# EasyEDA Pro project PAW4_NOMAG_Cheesecake-Blueberry-LSM6DSV_JST2.eprj

# Schematic LSM6DSV_QMC6309_Rv_1
Board Name: LSM6DSV_QMC6309_JST2; Create Date: 2026-08-04; Page Name: LSM6; Project Name: PAW4_NOMAG_Cheesecake-Blueberry-LSM6DSV_JST2; Schematic Name: LSM6DSV_QMC6309_Rv_1; Update Date: 2026-09-08; Company: Designed by SoraKage (& puppy sky); Page Size: A4; Version: paw-4
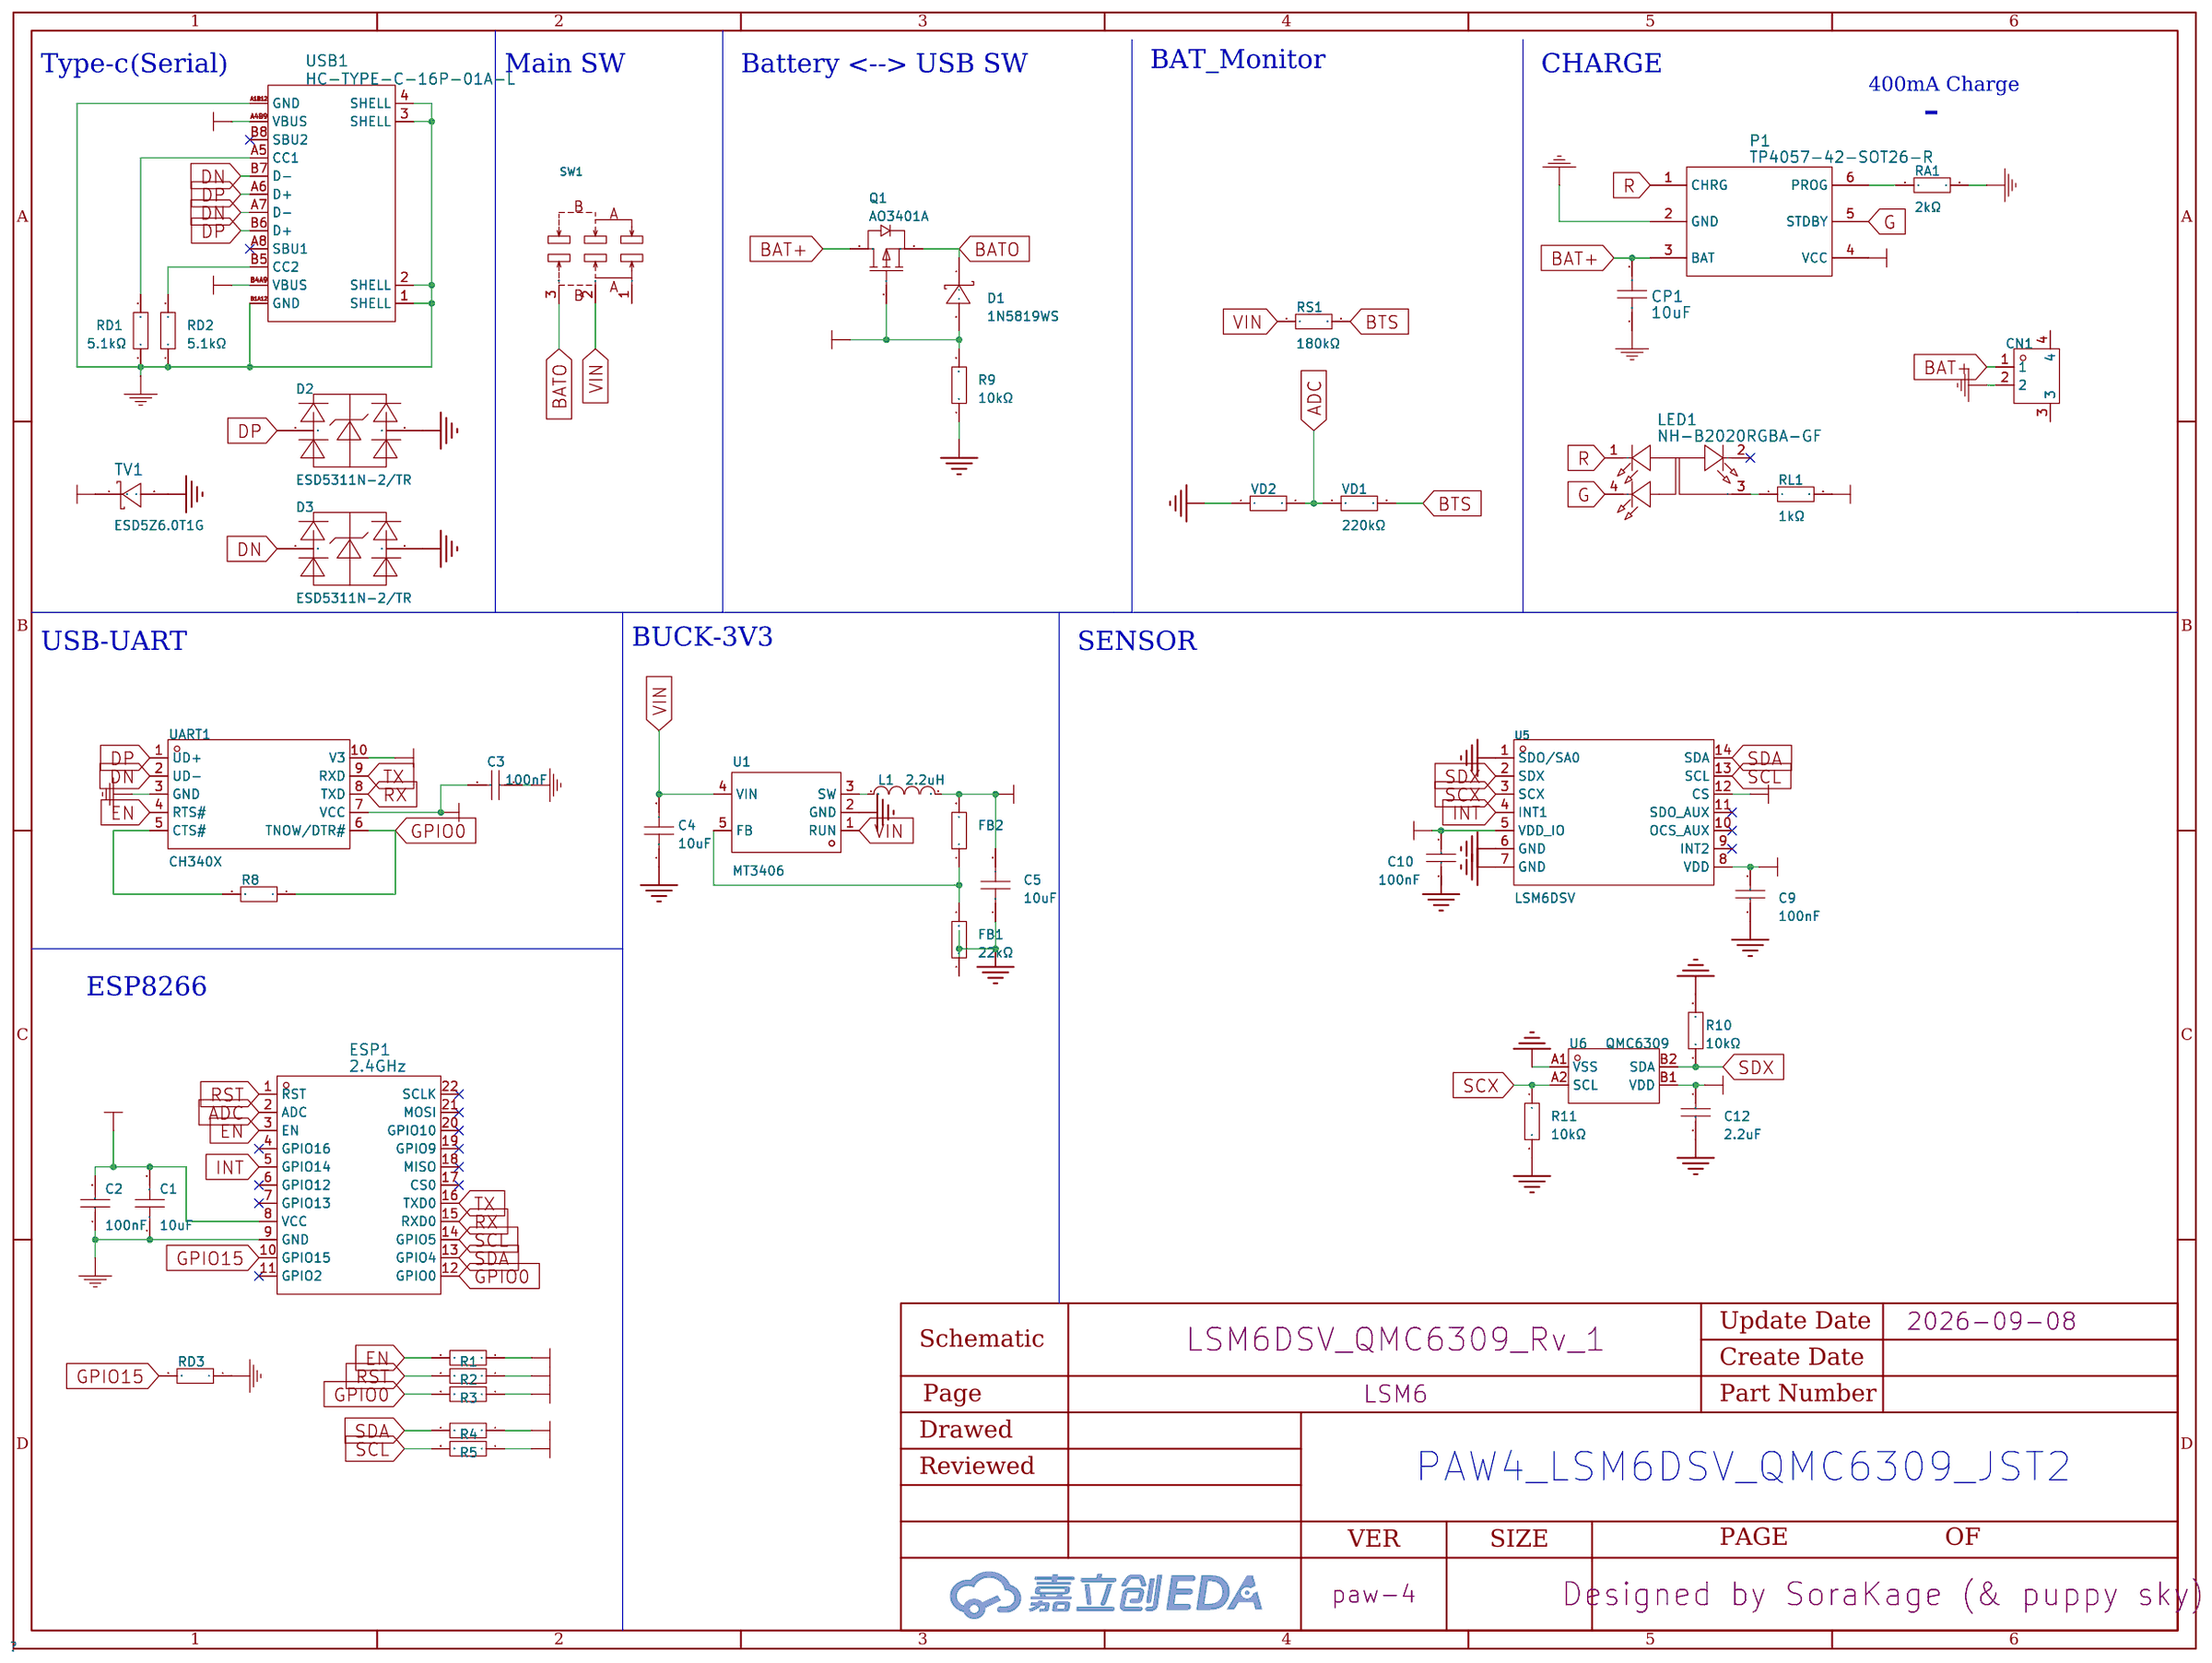
[diagram p0: schematic sheet]

## Parts
C1  10uF  [C0603]
C2  100nF  [C0402]
C3  100nF  [C0402]
C4  10uF  [C0603]
C5  10uF  [C0603]
C9  100nF  [C0402]
C10  100nF  [C0402]
C12  2.2uF  [C0402]
CN1  S2B-PH-SM4-TB(LF)(SN)  [CONN-SMD_P2.00_S2B-PH-SM4-TB-LF-SN]
CP1  10uF  [C0603]
D1  1N5819WS  [SOD-323_L1.8-W1.3-LS2.5-RD]
D2  ESD5311N-2/TR  [X1-DFN1006-2_L1.0-W0.6_ESD5311N-2-TR]
D3  ESD5311N-2/TR  [X1-DFN1006-2_L1.0-W0.6_ESD5311N-2-TR]
ESP1  2.4GHz  [WIFIM-SMD_ESP-12F-ESP8266MOD]
FB1  22kΩ  [R0402]
FB2  100kΩ  [R0402]
L1  2.2uH  [IND-SMD_L2.5-W2.0_YXMBL252010P]
LED1  NH-B2020RGBA-GF  [LED-ARRAY-SMD_4P-L2.1-W2.1-TL_NH-B2020RGBA]
P1  TP4057-42-SOT26-R  [SOT-23-6_L2.9-W1.6-P0.95-LS2.8-BL]
Q1  AO3401A  [SOT-23_L2.9-W1.3-P1.90-LS2.4-BR]
R1  4.7kΩ  [R0402]
R2  4.7kΩ  [R0402]
R3  4.7kΩ  [R0402]
R4  4.7kΩ  [R0402]
R5  4.7kΩ  [R0402]
R8  4.7kΩ  [R0402]
R9  10kΩ  [R0402]
R10  10kΩ  [R0402]
R11  10kΩ  [R0402]
RA1  2kΩ  [R0402]
RD1  5.1kΩ  [R0402]
RD2  5.1kΩ  [R0402]
RD3  4.7kΩ  [R0402]
RL1  1kΩ  [R0402]
RS1  180kΩ  [R0402]
SW1  K3-1280S-F1  [SW-SMD_K3-1280S-K1]
TV1  ESD5Z6.0T1G  [SOD-523F_L1.2-W0.8-LS1.7-RD]
U1  MT3406  [SOT-23-5_L3.0-W1.7-P0.95-LS2.8-BR]
U5  LSM6DSV  [LGA-14_L3.0-W2.5-P0.50-TL]
U6  QMC6309  [X1-WLB0808-4_L0.8-W0.8-P0.40-TL]
UART1  CH340X  [MSOP-10_L3.0-W3.0-P0.50-LS5.0-BL]
USB1  HC-TYPE-C-16P-01A-L  [USB-C-SMD_G-SWITCH_GT-USB-7010EN]
VD1  220kΩ  [R0402]
VD2  100kΩ  [R0402]

## Library data of the parts
C1 = CL10A106KP8NNNC: Capacitance:10uF Tolerance:±10% Tolerance:±10% Voltage Rating:10V Temperature Coefficient:X5R; LCSC Part Name: 10uF ±10% 10V; Supplier Part: C19702; Manufacturer: SAMSUNG(三星); Supplier Footprint: 0603; JLCPCB Part Class: Basic Part; Datasheet: https://item.szlcsc.com/datasheet/CL10A106KP8NNNC/20411.html; Supplier: LCSC; Tolerance: ±10%; Voltage Rating: 10V; Temperature Coefficient: X5R
C2 C3 C9 C10 = CL05B104KO5NNNC: 容值:100nF;精度:±10%;额定电压:16V;材质(温度系数):X7R;; LCSC Part Name: 100nF ±10% 16V; Supplier Part: C1525; Manufacturer: SAMSUNG(三星); Supplier Footprint: 0402; JLCPCB Part Class: Basic Part; Datasheet: https://atta.szlcsc.com/upload/public/pdf/source/20160103/1457707674891.pdf; Supplier: LCSC; Tolerance: ±10%; Voltage Rated: 16V; Temperature Coefficient: X7R
C4 C5 = CL10A106KP8NNNC: 容值:10uF;精度:±10%;额定电压:10V;材质(温度系数):X5R;; LCSC Part Name: 10uF ±10% 10V; Supplier Part: C19702; Manufacturer: SAMSUNG(三星); Supplier Footprint: 0603; JLCPCB Part Class: 基础库; Datasheet: https://atta.szlcsc.com/upload/public/pdf/source/20160103/1457707703378.pdf; Supplier: LCSC; Tolerance: ±10%; Voltage Rated: 10V; Temperature Coefficient: X5R
C12 = 0402X225K6R3NT: Capacitance:2.2uF Tolerance:±10% Tolerance:±10% Voltage Rating:6.3V Temperature Coefficient:X5R; LCSC Part Name: 2.2uF ±10% 6.3V; Supplier Part: C193620; Manufacturer: FH(风华); Supplier Footprint: 0402; JLCPCB Part Class: Extended Part; Datasheet: https://item.szlcsc.com/datasheet/0402X225K6R3NT/231786.html; Supplier: LCSC; Tolerance: ±10%; Voltage Rating: 6.3V; Temperature Coefficient: X5R
CN1 = S2B-PH-SM4-TB(LF)(SN): LCSC Part Name: 1x2P 间距:2mm 卧贴 系列:PH; Supplier Part: C295747; Manufacturer: JST; Supplier Footprint: SMD,P=2mm,卧贴; JLCPCB Part Class: Extended Part; Datasheet: https://item.szlcsc.com/datasheet/S2B-PH-SM4-TB(LF)(SN)/280164.html; Supplier: LCSC; Pins Structure: 1x2P; Pitch: 2mm; Mounting Type: Surface Mount, Right Angle; Reference Series: PH; Number of Pins: 2P; Number of Rows: 1; Number of PINs Per Row: 2; Current Rating: 2A; Contact Material: Copper alloy; Contact Plating: Tin; Operating Temperature: -25℃~+85℃; Voltage Rating: 100V; Plastic Material: PA; Flame Retardant Rating: UL94V-0; Supplementary Features: Auxiliary Solder Pin; Color: Beige; Z-Height of the Board: 5.5mm; X-Length of Bottom Edge on Board (Spacing Line): 7.9mm; Y-Width of Bottom Edge on Board: 8.6mm
CP1 = 10uF: link: https://item.szlcsc.com/362304.html; 3DModel: C0603_L1.6-W0.8-H0.8; Supplier: LCSC; Manufacturer: SAMSUNG(三星); Manufacturer Part: CL10A106KP8NNNC; Supplier Part: C19702; JLCPCB Part Class: Basic Part
D1 = 1N5819WS_C191023: 直流反向耐压(Vr):40V;平均整流电流(Io):1A;正向压降(Vf):600mV@1A;; LCSC Part Name: 40V 1A 600mV@1A; Supplier Part: C191023; Manufacturer: Hottech(合科泰); Supplier Footprint: SOD-323; JLCPCB Part Class: 基础库; Datasheet: https://atta.szlcsc.com/upload/public/pdf/source/20220428/3CB86FD8D28D653594B4E35F9D5AEFD9.pdf; Supplier: LCSC; Reverse Voltage (Vr): 40V; Average Rectified Current (Io): 1A; Forward Voltage (Vf@If): 600mV@1A
D2 D3 = ESD5311N-2/TR: LCSC Part Name: 双向TVS 5V截止 峰值浪涌电流：4A@8/20us; Supplier Part: C153721; Manufacturer: WILLSEMI(韦尔); Supplier Footprint: DFN1006-2L; JLCPCB Part Class: Extended Part; Datasheet: https://item.szlcsc.com/datasheet/ESD5311N-2%252FTR/165063.html; Supplier: LCSC; Polarity: Bidirectional; Reverse Stand-Off Voltage (Vrwm): 5V; Clamping Voltage: 21V; Peak Pulse Current (Ipp): 4A@8/20us; Voltage - Breakdown: 9V; Reverse Leakage Current (Ir): 1nA; Number of Channels: 1; level of protection: IEC 61000-4-5；IEC 61000-4-2; Type: TVS; Junction Capacitance: 0.25pF
ESP1 = ESP-12F(ESP8266MOD): 核心处理器:ESP8266芯片;频率:2.4GHz;天线形式:板载PCB天线;发射功率:16dBm;接收灵敏度:-90dBm;; LCSC Part Name: 完整的802.11b/g/nWi-FiSoC模块; Supplier Part: C82891; Manufacturer: Ai-Thinker(安信可); Supplier Footprint: SMD,16x24mm; JLCPCB Part Class: Extended Part; Datasheet: https://atta.szlcsc.com/upload/public/pdf/source/20210219/C82891_ABD84A460F4F056A2757267CCCA4B508.pdf; Supplier: LCSC; Output Power: 16dBm; Core Processor: ESP8266芯片; Support Interface: GPIO；UART；I2C；PWM；SPI；ADC; Antenna Type: 板载PCB天线; Operating Voltage: 3.3V; Receive  Current: 120mA; Send  Current: 170mA; Sensitivity: -90dBm; Operating Temperature: -40℃~+85℃
FB1 = 0402WGF2202TCE: 电阻类型:厚膜电阻;阻值:22kΩ;精度:±1%;功率:62.5mW;; LCSC Part Name: 22kΩ ±1% 62.5mW; Supplier Part: C25768; Manufacturer: UNI-ROYAL(厚声); Supplier Footprint: 0402; JLCPCB Part Class: 基础库; Datasheet: https://atta.szlcsc.com/upload/public/pdf/source/20200306/C422600_1E6D84923E4A46A82E41ADD87F860B5C.pdf; Supplier: LCSC; Type: 厚膜电阻; Tolerance: ±1%; Power(Watts): 62.5mW; Temperature Coefficient: ±100ppm/℃; Overload Voltage (Max): 50V; Operating Temperature Range: -55℃~+155℃
FB2 VD2 = 0402WGF1003TCE: Type:Thick Film Resistor Resistance:100kΩ Tolerance:±1% Tolerance:±1% Power(Watts):62.5mW Voltage-Supply(Max):50V Temperature Coefficient:±100ppm/℃ Temperature Coefficient:±100ppm/℃ Operating Temperature:-55℃~+155℃ Operating Temperature:-55℃~+155℃; LCSC Part Name: 100kΩ ±1% 62.5mW 厚膜电阻; Supplier Part: C25741; Manufacturer: UNI-ROYAL(厚声); Supplier Footprint: 0402; JLCPCB Part Class: Basic Part; Datasheet: https://item.szlcsc.com/datasheet/0402WGF1003TCE/26484.html; Supplier: LCSC; Type: Thick Film Resistor; Tolerance: ±1%; Power(Watts): 62.5mW; Voltage-Supply(Max): 50V; Temperature Coefficient: ±100ppm/℃; Operating Temperature: -55℃~+155℃
L1 = APH252010T2R2M: 类型:一体成型电感;电感值:2.2uH;精度:±20%;额定电流:2.1A;饱和电流(Isat):3A;; LCSC Part Name: 2.2uH ±20% 3A; Supplier Part: C5349606; Manufacturer: APV(爱普微); Supplier Footprint: L252010; JLCPCB Part Class: 扩展库; Datasheet: https://atta.szlcsc.com/upload/public/pdf/source/20230112/CD71A991BF44148C80048C09E1A9BC6B.pdf; Supplier: LCSC; Type: 一体成型电感; Tolerance: ±20%; Rated Current: 2.1A; Saturation Current (Isat): 3A; DC Resistance (DCR): 70mΩ
LED1 = NH-B2020RGBA-GF: Supplier Part: C52212030; Manufacturer: 国星光电; Supplier Footprint: SMD-4P,2.1x2.1mm; JLCPCB Part Class: Extended Part; Datasheet: https://item.szlcsc.com/datasheet/NH-B2020RGBA-GF/55063765.html; Supplier: LCSC
P1 = TP4057-42-SOT26-R: LCSC Part Name: TP4057 1%; Supplier Part: C12044; Manufacturer: TOPPOWER(南京拓微); Supplier Footprint: SOT-23-6; JLCPCB Part Class: Extended Part; Datasheet: https://atta.szlcsc.com/upload/public/pdf/source/20140228/1457706997013.pdf; Supplier: LCSC
Q1 = AO3401A_C15127: 类型:P沟道;漏源电压(Vdss):30V;连续漏极电流(Id):4A;功率(Pd):1.4W;导通电阻(RDS(on)@Vgs,Id):44mΩ@10V,4.3A;; LCSC Part Name: P沟道 30V 4A; Supplier Part: C15127; Manufacturer: AOS; Supplier Footprint: SOT-23-3L; JLCPCB Part Class: 基础库; Datasheet: https://atta.szlcsc.com/upload/public/pdf/source/20160507/1462613609053.pdf; Supplier: LCSC; Type: P沟道; Drain Source Voltage (Vdss): 30V; Continuous Drain Current (Id): 4A; Power Dissipation (Pd): 1.4W; Drain Source On Resistance (RDS(on)@Vgs,Id): 44mΩ@10V,4.3A; Gate Threshold Voltage (Vgs(th)@Id): 1.3V@250uA
R1-R5 R8 RD3 = 0402WGF4701TCE: Type:Thick Film Resistor Resistance:4.7kΩ Tolerance:±1% Tolerance:±1% Power(Watts):62.5mW Voltage-Supply(Max):50V Temperature Coefficient:±100ppm/℃ Temperature Coefficient:±100ppm/℃ Operating Temperature:-55℃~+155℃ Operating Temperature:-55℃~+155℃; LCSC Part Name: 4.7kΩ ±1% 62.5mW 厚膜电阻; Supplier Part: C25900; Manufacturer: UNI-ROYAL(厚声); Supplier Footprint: 0402; JLCPCB Part Class: Basic Part; Datasheet: https://item.szlcsc.com/datasheet/0402WGF4701TCE/26643.html; Supplier: LCSC; Type: Thick Film Resistor; Tolerance: ±1%; Power(Watts): 62.5mW; Voltage-Supply(Max): 50V; Temperature Coefficient: ±100ppm/℃; Operating Temperature: -55℃~+155℃
R9-R11 = 0402WGF1002TCE: 电阻类型:厚膜电阻;阻值:10kΩ;精度:±1%;功率:62.5mW;; LCSC Part Name: 10kΩ ±1% 62.5mW; Supplier Part: C25744; Manufacturer: UNI-ROYAL(厚声); Supplier Footprint: 0402; JLCPCB Part Class: 基础库; Datasheet: https://atta.szlcsc.com/upload/public/pdf/source/20200306/C422600_1E6D84923E4A46A82E41ADD87F860B5C.pdf; Supplier: LCSC; Type: 厚膜电阻; Tolerance: ±1%; Power(Watts): 62.5mW; Temperature Coefficient: ±100ppm/℃; Overload Voltage (Max): 50V; Operating Temperature Range: -55℃~+155℃
RA1 = 0402WGF2001TCE: 电阻类型:厚膜电阻;阻值:2kΩ;精度:±1%;功率:62.5mW;; LCSC Part Name: 2kΩ ±1% 62.5mW; Supplier Part: C4109; Manufacturer: UNI-ROYAL(厚声); Supplier Footprint: 0402; JLCPCB Part Class: 基础库; Datasheet: https://atta.szlcsc.com/upload/public/pdf/source/20200306/C422600_1E6D84923E4A46A82E41ADD87F860B5C.pdf; Supplier: LCSC; Type: 厚膜电阻; Tolerance: ±1%; Power(Watts): 62.5mW; Temperature Coefficient: ±100ppm/℃; Overload Voltage (Max): 50V; Operating Temperature Range: -55℃~+155℃
RD1 RD2 = 0402WGF5101TCE: 电阻类型:厚膜电阻;阻值:5.1kΩ;精度:±1%;功率:62.5mW;; LCSC Part Name: 5.1kΩ ±1% 62.5mW; Supplier Part: C25905; Manufacturer: UNI-ROYAL(厚声); Supplier Footprint: 0402; JLCPCB Part Class: 基础库; Datasheet: https://atta.szlcsc.com/upload/public/pdf/source/20200306/C422600_1E6D84923E4A46A82E41ADD87F860B5C.pdf; Supplier: LCSC; Type: 厚膜电阻; Tolerance: ±1%; Power(Watts): 62.5mW; Temperature Coefficient: ±100ppm/℃; Overload Voltage (Max): 50V; Operating Temperature Range: -55℃~+155℃
RL1 = 0402WGF1001TCE: 电阻类型:厚膜电阻;阻值:1kΩ;精度:±1%;功率:62.5mW;; LCSC Part Name: 1kΩ ±1% 62.5mW; Supplier Part: C11702; Manufacturer: UNI-ROYAL(厚声); Supplier Footprint: 0402; JLCPCB Part Class: 基础库; Datasheet: https://atta.szlcsc.com/upload/public/pdf/source/20200306/C422600_1E6D84923E4A46A82E41ADD87F860B5C.pdf; Supplier: LCSC; Type: 厚膜电阻; Tolerance: ±1%; Power(Watts): 62.5mW; Temperature Coefficient: ±100ppm/℃; Overload Voltage (Max): 50V; Operating Temperature Range: -55℃~+155℃
RS1 = 0402WGF1803TCE: 阻值:180kΩ;精度:±1%;功率:62.5mW;温度系数:±100ppm/℃;电阻类型:厚膜电阻;; LCSC Part Name: 180kΩ ±1% 62.5mW 厚膜电阻; Supplier Part: C25760; Manufacturer: UNI-ROYAL(厚声); Supplier Footprint: 0402; JLCPCB Part Class: 扩展库; Datasheet: https://atta.szlcsc.com/upload/public/pdf/source/20200306/C422600_1E6D84923E4A46A82E41ADD87F860B5C.pdf; Supplier: LCSC; Tolerance: ±1%; Power(Watts): 62.5mW; Overload Voltage (Max): 50V; Temperature Coefficient: ±100ppm/℃; Type: 厚膜电阻; Operating Temperature Range: -55℃~+155℃
SW1 = K3-1280S-F1_C92658: LCSC Part Name: 卧贴双档 滑动开关; Supplier Part: C92658; Manufacturer: 韩国韩荣; Supplier Footprint: SMD,9.1x3.7mm; JLCPCB Part Class: Extended Part; Datasheet: https://item.szlcsc.com/datasheet/K3-1280S-F1/93851.html; Supplier: LCSC; Circuit: SPDT; Actuator Style: Rectangular Columnar; Termination Style: Gull Wing; Length: 9.1mm; Width: 3.7mm; Switch Height: 3.5mm; Mounting Type: Surface Mount, Right Angle; Actuator Color: Black; Current Rating: 300mA; Voltage Rating: 6V; Life: 10,000 Cycles; Operating Temperature: -25℃~+80℃
TV1 = ESD5Z6.0T1G: LCSC Part Name: 单向ESD 6V截止 峰值脉冲电流：8.8A; Supplier Part: C82323; Manufacturer: onsemi(安森美); Supplier Footprint: SOD-523; JLCPCB Part Class: Extended Part; Datasheet: https://item.szlcsc.com/datasheet/ESD5Z6.0T1G/83480.html; Supplier: LCSC; Polarity: Unidirectional; Reverse Stand-Off Voltage (Vrwm): 6V; Clamping Voltage: 12.4V; Peak Pulse Current (Ipp): 8.8A; Peak Pulse Power Dissipation (Ppp): 181W@8/20us; Voltage - Breakdown: 6.8V; Reverse Leakage Current (Ir): 10nA; Number of Channels: 1; Operating Temperature: -55℃~+150℃; level of protection: IEC 61000-4-4；IEC 61000-4-2; Type: ESD; Junction Capacitance: 70pF
U1 = MT3406: Function:Buck Voltage - Supply:2V~6V Voltage - Supply:2V~6V Output Voltage:600mV~6V Output Voltage:600mV~6V Output Current:1A Frequency - Switching:1.5MHz Frequency - Switching:1.5MHz Operating Temperature:-40℃~+85℃@(TA) Operating Temperature:-40℃~+85℃@(T; LCSC Part Name: 1A，2V-6V输入，1.5MHz同步降压转换器; Supplier Part: C22462728; Manufacturer: 西安航天民芯; Supplier Footprint: SOT-23-5; JLCPCB Part Class: Extended Part; Datasheet: https://item.szlcsc.com/datasheet/MT3406/24149576.html; Supplier: LCSC; Function: Buck; Voltage - Supply: 2V~6V; Output Voltage: 600mV~6V; Output Current: 1A; Frequency - Switching: 1.5MHz; Operating Temperature: -40℃~+85℃@(TA); Synchronous Rectifier: Yes; Number of Outputs: 1; Topology: Buck; Quiescent Current: 10uA; Switch tube (built-in/external): Built-in; Output Type: Adjustable
U5 = LSM6DSVQTR: Supplier Part: C17496470; Manufacturer: ST(意法半导体); JLCPCB Part Class: Extended Part; Supplier: LCSC
U6 = QMC6309: LCSC Part Name: 三轴单芯片磁传感器; Supplier Part: C5439871; Manufacturer: QST(上海矽睿); Supplier Footprint: WLCSP-4(0.8x0.8); JLCPCB Part Class: Extended Part; Datasheet: https://item.szlcsc.com/datasheet/QMC6309/6319593.html; Supplier: LCSC; Magnetic Sensing Range(X,Y): ±3.2mT; Magnetic Sensing Range(Z): ±3.2mT; Output bit: 16bit; Interface Type: I2C; Voltage - Supply: 2.5V~3.6V; Current - Supply: 10uA；6uA; Operating Temperature: -40℃~+85℃; Features: Built-in self-test (BIST)；On-chip set/reset coil；Built-in temperature sensor
UART1 = CH340X: Supplier Part: C3035748; Manufacturer: WCH(南京沁恒); Supplier Footprint: MSOP-10; JLCPCB Part Class: Extended Part; Supplier: LCSC
USB1 = HC-TYPE-C-16P-01A-L: Connector Type:Type-C Protocol Standard:USB 3.1 Gender:Female Mounting Type:Surface Mount, Right Angle Number of Contacts:16P Number of Ports:1 Current Rating-Power:3A Connect-Disconnect Life:10,000 cycles Detection color:Blue Operating Temperature:-25℃~+; LCSC Part Name: Type-C 母 卧贴; Supplier Part: C2997432; Manufacturer: HCTL(华灿天禄); Supplier Footprint: SMD; JLCPCB Part Class: Extended Part; Datasheet: https://item.szlcsc.com/datasheet/HC-TYPE-C-16P-01A-L/3468395.html; Supplier: LCSC; Connector Type: Type-C; Protocol Standard: USB 3.1; Gender: Female; Mounting Type: Surface Mount, Right Angle; Number of Contacts: 16P; Number of Ports: 1; Current Rating-Power: 3A; Connect-Disconnect Life: 10,000 cycles; Detection color: Blue; Operating Temperature: -25℃~+85℃
VD1 = 0402WGF2203TCE: 电阻类型:厚膜电阻;阻值:220kΩ;精度:±1%;功率:62.5mW;; LCSC Part Name: 220kΩ ±1% 62.5mW; Supplier Part: C25767; Manufacturer: UNI-ROYAL(厚声); Supplier Footprint: 0402; JLCPCB Part Class: 基础库; Datasheet: https://atta.szlcsc.com/upload/public/pdf/source/20200306/C422600_1E6D84923E4A46A82E41ADD87F860B5C.pdf; Supplier: LCSC; Type: 厚膜电阻; Tolerance: ±1%; Power(Watts): 62.5mW; Temperature Coefficient: ±100ppm/℃; Overload Voltage (Max): 50V; Operating Temperature Range: -55℃~+155℃

## Nets
3V3: C1.2 C2.2 C3.2 C5.2 C9.1 C10.1 C12.2 ESP1.8(VCC) FB2.2 L1.2 R1.1 R2.1 R3.1 R4.1 R5.1 U5.5(VDD_IO) U5.8(VDD) U5.12(CS) U6.B1(VDD) UART1.7(VCC) UART1.10(V3)
+5V: D1.2(A) P1.4(VCC) Q1.1(G) R9.2 RL1.2 TV1.1(K) USB1.A4B9(VBUS) USB1.B4A9(VBUS)
GND: C1.1 C2.1 C3.1 C4.1 C5.1 C9.2 C10.2 C12.1 CN1.2 CP1.1 D2.2 D3.2 ESP1.9(GND) FB1.1 P1.2(GND) R9.1 R10.2 R11.2 RA1.2 RD1.1 RD2.1 RD3.1 TV1.2(A) U1.2(GND) U5.1(SDO/SA0) U5.6(GND) U5.7(GND) U6.A1(VSS) UART1.3(GND) USB1.1(SHELL) USB1.2(SHELL) USB1.3(SHELL) USB1.4(SHELL) USB1.A1B12(GND) USB1.B1A12(GND) VD2.1
VIN: C4.2 RS1.1 SW1.2 U1.1(RUN) U1.4(VIN)
ADC: ESP1.2(ADC) VD1.1 VD2.2
BAT+: CN1.1 CP1.2 P1.3(BAT) Q1.3(D)
BATO: D1.1(K) Q1.2(S) SW1.3
BTS: RS1.2 VD1.2
CC1: RD1.2 USB1.A5(CC1)
CC2: RD2.2 USB1.B5(CC2)
CTS: R8.2 UART1.5(CTS#)
DN: D3.1 UART1.2(UD-) USB1.A7(D-) USB1.B7(D-)
DP: D2.1 UART1.1(UD+) USB1.A6(D+) USB1.B6(D+)
EN: ESP1.3(EN) R1.2 UART1.4(RTS#)
FB: FB1.2 FB2.1 U1.5(FB)
G: LED1.4(-) P1.5(STDBY)
GPIO0: ESP1.12(GPIO0) R3.2 R8.1 UART1.6(TNOW/DTR#)
GPIO15: ESP1.10(GPIO15) RD3.2
INT: ESP1.5(GPIO14) U5.4(INT1)
LED+: LED1.3(+) RL1.1
PROG: P1.6(PROG) RA1.1
R: LED1.1(-) P1.1(CHRG)
RST: ESP1.1(RST) R2.2
RX: ESP1.15(RXD0) UART1.8(TXD)
SCL: ESP1.14(GPIO5) R5.2 U5.13(SCL)
SCX: R11.1 U5.3(SCX) U6.A2(SCL)
SDA: ESP1.13(GPIO4) R4.2 U5.14(SDA)
SDX: R10.1 U5.2(SDX) U6.B2(SDA)
SW: L1.1 U1.3(SW)
TX: ESP1.16(TXD0) UART1.9(RXD)

Not connected (* = marked no-connect by the designer): CN1 3 4; ESP1 4(GPIO16)* 6(GPIO12)* 7(GPIO13)* 11(GPIO2)* 17(CS0)* 18(MISO)* 19(GPIO9)* 20(GPIO10)* 21(MOSI)* 22(SCLK)*; LED1 2(-)*; SW1 1; U5 9(INT2)* 10(OCS_AUX)* 11(SDO_AUX)*; USB1 A8(SBU1)* B8(SBU2)*

## Notes on the sheet
- Type-c(Serial)
- Main SW
- Battery <--> USB SW
- BAT_Monitor
- CHARGE
- 400mA Charge
- -
- USB-UART
- BUCK-3V3
- SENSOR
- ESP8266
- PAW4_LSM6DSV_QMC6309_JST2

# Board LSM6DSV_QMC6309_Rv_1
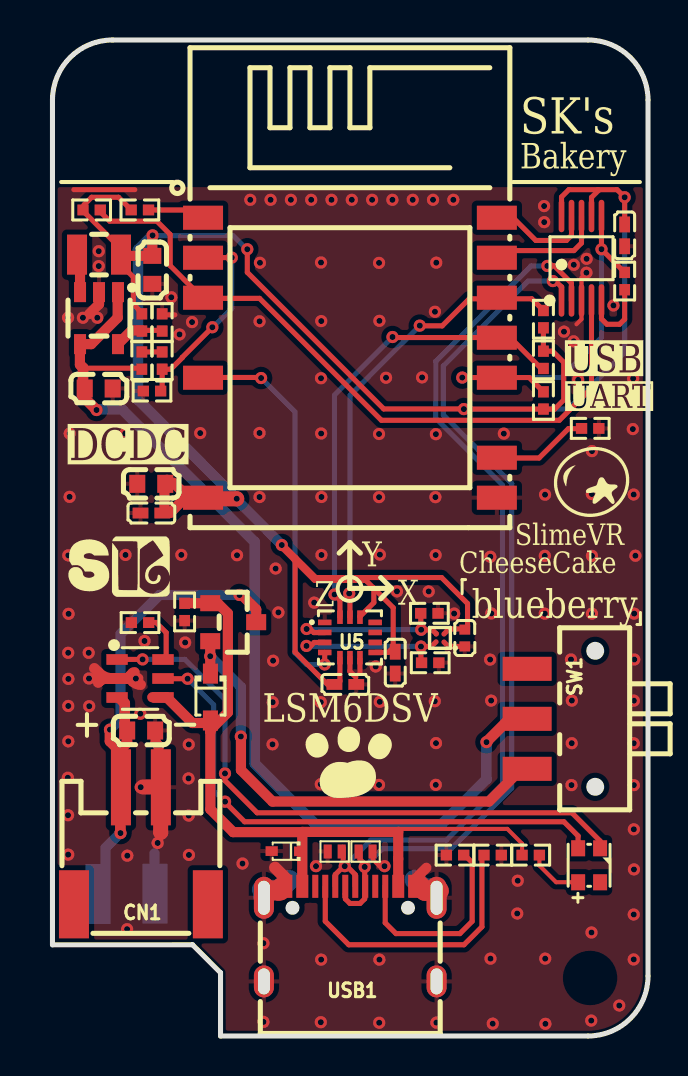
[diagram p1: board, top side]
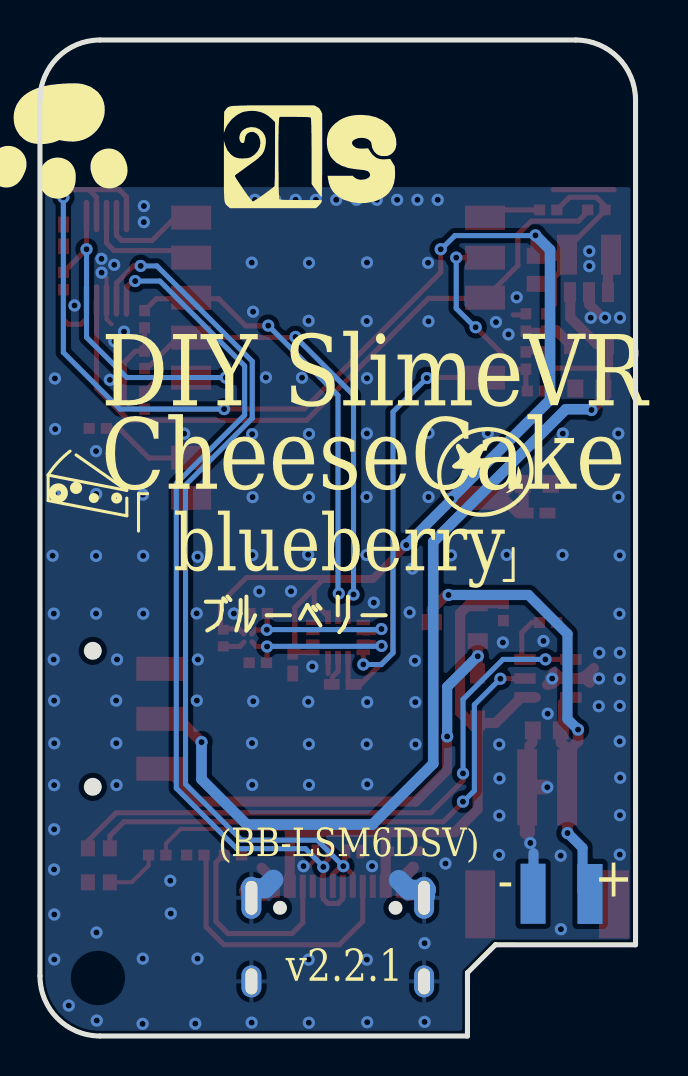
[diagram p2: board, bottom side, seen from below]

Outline 29.8 x 49.8 mm; copper layers: Top Layer, Bottom Layer. Coordinates in mm from the lower left corner of the outline.
Outline path: 0,4.56 0,46.8 arc(0.88,48.92) 3,49.8 26.8,49.8 arc(28.92,48.92) 29.8,46.8 29.8,3 arc(28.92,0.88) 26.8,0 8.41,0 8.41,3.16 7.01,4.56 0,4.56
Stack: Top Layer 0.035mm / Dielectric1 0.91mm FR4 er 4.5 / Bottom Layer 0.035mm

## Design rules (mm)
spacing Default (default): track to track 0.127, other pairs 0 to 0.127
track width Default (default): min 0.127, default 0.127, max 25.4
differential pair differentialPair (default): width min 0.127, default 0.254, max 2.54; gap min 0.152, default 0.152
via Default (default): diameter min 0.61, default 0.61, max 100.025; hole min 0.305, default 0.305, max 59.995
net GND uses gge20888(1)

## Placement (name value [footprint] x y rotation side)
C1  10uF  [C0603]  4.94 27.61 0 top
C2  100nF  [C0402#2]  4.95 26.15 0 top
C3  100nF  [C0402#2]  28.63 40.03 90 top
C4  10uF  [C0603]  2.31 32.37 180 top
C5  10uF  [C0603]  5 38.31 90 top
C9  100nF  [C0402#2]  17.15 18.67 270 top
C10  100nF  [C0402#2]  14.66 17.58 0 top
C12  2.2uF  [C0402]  20.63 19.9 90 top
CN1  S2B-PH-SM4-TB(LF)(SN)  [CONN-SMD_P2.00_S2B-PH-SM4-TB-LF-SN]  4.43 9.51 0 top
CP1  10uF  [C0603]  4.44 15.27 180 top
D1  1N5819WS  [SOD-323_L1.8-W1.3-LS2.5-RD]  7.9 16.95 270 top
D2  ESD5311N-2/TR  [X1-DFN1006-2_L1.0-W0.6_ESD5311N-2-TR]  15.67 9.22 0 top
D3  ESD5311N-2/TR  [X1-DFN1006-2_L1.0-W0.6_ESD5311N-2-TR]  14.12 9.22 180 top
ESP1  2.4GHz  [wifim-smd_esp-12f-esp8266mod]  14.89 33.26 270 top
FB1  22kΩ  [R0402]  5.49 35.68 270 top
FB2  100kΩ  [R0402]  4.47 35.68 90 top
L1  2.2uH  [IND-SMD_L2.5-W2.0_YXMBL252010P]  2.33 39.07 180 top
LED1  NH-B2020RGBA-GF  [LED-ARRAY-SMD_4P-L2.1-W2.1-TL_NH-B2020RGBA]  26.85 8.54 270 top
NOREF  -  [Pad_e268]  5.13 7.11 0 top
NOREF#2  -  [Pad_e264]  2.28 7.1 0 top
P1  TP4057-42-SOT26-R  [SOT-23-6_L2.9-W1.6-P0.95-LS2.8-BL]  4.38 17.88 270 top
Q1  AO3401A  [SOT-23_L2.9-W1.3-P1.90-LS2.4-BR]  9.04 20.69 180 top
R1  4.7kΩ  [R0402]  1.96 41.3 0 top
R2  4.7kΩ  [R0402]  4.37 41.3 0 top
R3  4.7kΩ  [R0402]  24.57 31.78 90 top
R4  4.7kΩ  [R0402]  24.57 33.81 270 top
R5  4.7kΩ  [R0402]  24.57 35.84 90 top
R8  4.7kΩ  [R0402]  28.63 37.75 270 top
R9  10kΩ  [R0402]  6.61 21.2 90 top
R10  10kΩ  [R0402]  18.86 21.13 0 top
R11  10kΩ  [R0402]  18.9 18.66 0 top
RA1  2kΩ  [R0402]  4.38 20.67 180 top
RD1  5.1kΩ  [R0402]  22.03 9.04 180 top
RD2  5.1kΩ  [R0402]  20.14 9.04 0 top
RD3  4.7kΩ  [R0402]  26.91 30.38 180 top
RL1  1kΩ  [R0402]  23.93 9.04 180 top
RS1  180kΩ  [R0402]  4.47 33.77 90 top
SW1  K3-1280S-F1  [SW-SMD_K3-1280S-K1]  23.75 15.86 0 top
TV1  ESD5Z6.0T1G  [SOD-523F_L1.2-W0.8-LS1.7-RD]  11.68 9.24 180 top
U1  MT3406  [SOT-23-5_L3.0-W1.7-P0.95-LS2.8-BR]  2.33 35.89 90 top
U5  LSM6DSV  [LGA-14_L3.0-W2.5-P0.50-TL]  14.89 19.93 0 top
U6  QMC6309  [X1-WLB0808-4_L0.8-W0.8-P0.40-TL]  19.39 19.91 180 top
UART1  CH340X  [MSOP-10_L3.0-W3.0-P0.50-LS5.0-BL]  26.47 38.89 0 top
USB1  HC-TYPE-C-16P-01A-L  [USB-C-SMD_G-SWITCH_GT-USB-7010EN]  14.9 5.11 0 top
VD1  220kΩ  [R0402]  5.49 33.77 90 top
VD2  100kΩ  [R0402]  4.98 32.25 0 top

## Footprints (pads in the part's own frame, mm; a bottom-side part is the same pattern mirrored in y, then rotated)
C0402
  rect 0.5x0.54 smd: 1(-0.42,0) 2(0.42,0)
C0402#2
  rect 0.79x0.54 smd: 1(-0.545,0) 2(0.545,0)
C0603
  rect 0.8x0.9 smd: 1(-0.7,0) 2(0.7,0)
CONN-SMD_P2.00_S2B-PH-SM4-TB-LF-SN
  rect 1x3.8 smd: 1(-1,2.925) 2(1,2.925)
  rect 1.5x3.4 smd: 3(3.35,-2.925) 4(-3.35,-2.925)
IND-SMD_L2.5-W2.0_YXMBL252010P
  rect 1x2 smd: 1(1.1,0) 2(-1.1,0)
LED-ARRAY-SMD_4P-L2.1-W2.1-TL_NH-B2020RGBA
  rect 0.8x0.7 smd: 1(-0.85,0.55) 2(0.85,0.55) 3(0.85,-0.55) 4(-0.85,-0.55)
LGA-14_L3.0-W2.5-P0.50-TL
  rect 0.675x0.28 smd: 1(-1.262,0.75) 2(-1.262,0.25) 3(-1.262,-0.25) 4(-1.262,-0.75) 8(1.262,-0.75) 9(1.262,-0.25) 10(1.262,0.25) 11(1.262,0.75)
  rect 0.28x0.675 smd: 5(-0.5,-1.012) 6(0,-1.012) 7(0.5,-1.012) 12(0.5,1.012) 13(0,1.012) 14(-0.5,1.012)
MSOP-10_L3.0-W3.0-P0.50-LS5.0-BL
  oval 0.28x1.62 smd: 1(-1,-2.11) 2(-0.5,-2.11) 3(0,-2.11) 4(0.5,-2.11) 5(1,-2.11) 6(1,2.11) 7(0.5,2.11) 8(0,2.11) 9(-0.5,2.11) 10(-1,2.11)
Pad_e264
  rect 1.25x3 smd far side: 1(0,0)
Pad_e268
  rect 1.25x3 smd far side: 2(0,0)
R0402
  rect 0.566x0.54 smd: 1(-0.433,0) 2(0.433,0)
SOD-323_L1.8-W1.3-LS2.5-RD
  rect 1x0.75 smd: 1(-1.173,0) 2(1.173,0)
SOD-523F_L1.2-W0.8-LS1.7-RD
  custom 0.609x0.483 smd: 1(-0.711,0.005) 2(0.711,-0.005)
SOT-23-5_L3.0-W1.7-P0.95-LS2.8-BR
  rect 1x0.6 smd: 1(1.3,-0.95) 2(1.3,0) 3(1.3,0.95) 4(-1.3,0.95) 5(-1.3,-0.95)
SOT-23-6_L2.9-W1.6-P0.95-LS2.8-BL
  rect 0.532x1.072 smd: 1(-0.95,-1.149) 2(0,-1.149) 3(0.95,-1.149) 4(0.95,1.149) 5(0,1.149) 6(-0.95,1.149)
SOT-23_L2.9-W1.3-P1.90-LS2.4-BR
  rect 1x0.8 smd: 1(1.15,-0.95) 2(1.15,0.95) 3(-1.15,0)
SW-SMD_K3-1280S-K1
  rect 2.45x1.2 smd: 1(0,2.5) 2(0,0) 3(0,-2.5)
USB-C-SMD_G-SWITCH_GT-USB-7010EN
  oval 1x2.1 hole 0.6x1.7: 1(-4.32,1.802) 2(4.32,1.802)
  oval 1x1.6 hole 0.6x1.3: 3(4.32,-2.377) 4(-4.32,-2.377)
  rect 0.6x1.15 smd: A1B12(-3.2,2.377) A4B9(-2.4,2.377) B1A12(3.2,2.377) B4A9(2.4,2.377)
  rect 0.3x1.15 smd: A5(-1.25,2.377) A6(-0.25,2.377) A7(0.25,2.377) A8(1.25,2.377) B5(1.75,2.377) B6(0.75,2.377) B7(-0.75,2.377) B8(-1.75,2.377)
wifim-smd_esp-12f-esp8266mod
  rect 1.2x2 smd: 1(-7.651,-7.351) 2(-5.651,-7.351) 3(-3.651,-7.351) 5(0.349,-7.351) 8(6.349,-7.351) 9(6.349,7.35) 10(4.349,7.35) 12(0.349,7.351) 13(-1.651,7.35) 14(-3.651,7.351) 15(-5.651,7.351) 16(-7.651,7.351)
X1-DFN1006-2_L1.0-W0.6_ESD5311N-2-TR
  rect 0.4x0.7 smd: 1(-0.35,0) 2(0.35,0)
X1-WLB0808-4_L0.8-W0.8-P0.40-TL
  round 0.18 smd: A1(-0.2,0.2) A2(0.2,0.2) B1(-0.2,-0.2) B2(0.2,-0.2)

## Nets
As in the schematic, except:
GND: C1.1 C2.1 C3.1 C4.1 C5.1 C9.2 C10.2 C12.1 CN1.2 CP1.1 D2.2 D3.2 ESP1.9 FB1.1 NOREF.2 P1.2 R9.1 R10.2 R11.2 RA1.2 RD1.1 RD2.1 RD3.1 TV1.2 U1.2 U5.1 U5.6 U5.7 U6.A1 UART1.3 USB1.1 USB1.2 USB1.3 USB1.4 USB1.A1B12 USB1.B1A12 VD2.1
BAT+: CN1.1 CP1.2 NOREF#2.1 P1.3 Q1.3

Pads without a net: CN1 3 4; LED1 2; SW1 1; U5 9 10 11; USB1 A8 B8

## Via types
v1: diameter 0.61, hole 0.305, Top Layer to Bottom Layer, 183 vias

## Routing (per net, layer and track width the routed paths; a pad name or vN(x,y) marks a point on that pad's centre or on a via; arc(x,y) is an arc through that point)
3V3: length 118.3
  Top Layer w0.254: 15.43,22.92 19.47,22.92 20.77,21.62 20.77,20.45 20.67,20.35 ; 27.3,42.32 28.25,42.32 v1(28.63,41.94) C3.2 ; 27.3,42.32 25.84,42.32 25.47,41.95 UART1.10 ; 27.3,42.32 27.33,42.29 26.97,41.93 UART1.7 ; 19.59,20.1 19.84,20.35 20.67,20.35 ; 14.38,18.9 14.38,17.73 14.27,17.62 ; 14.06,17.48 14.05,17.48 13.86,17.48 12.14,19.2 12.14,23.87 ; 20.73,31.35 24.41,31.35 ; 3.49,39.01 3.49,38.5 4.05,37.94 4.05,36.58 4.45,36.18 ; 3.41,39.07 3.41,39.37 1.58,41.2 1.58,41.56 1.96,41.94 3.31,41.94 R2.1 ; 15.38,20.98 15.39,20.98 16.08,21.67 16.08,22.38 16.04,22.43 ; 20.67,20.35 20.67,20.34 ; 20.67,20.35 20.67,20.35 ; v1(9.75,39.34) 9.75,38.18 16.58,31.35 20.6,31.35 ; 16.15,19.18 16.8,19.18 17.05,19.43 17.05,21.41 16.04,22.43 ; 16.04,22.43 15.72,22.75 15.72,22.85 ; 24.69,31.34 25.13,31.34 25.58,31.8 25.58,33.68 25.02,34.24 R4.1 R5.1
  Top Layer w0.4: v1(11.48,24.55) 11.48,24.52 13.14,22.85 15.64,22.85
  Top Layer w0.508: 5.73,27.81 5.73,27.81 ; 5.6,27.6 5.6,26.18 ; 6.05,27.67 6.83,26.89 ; 5.47,26.15 5.88,26.15 6.58,26.85 6.58,26.85 ; v1(5.01,40.03) 5,40.02 C5.2 3.49,39.01 L1.2
  Top Layer w0.75: v1(9.22,26.86) 9.22,26.86 7.42,26.86
  Bottom Layer w0.254: 28.65,41.93 28.63,41.92 28.63,34.18 25.8,31.35 v1(20.59,31.35) ; 9.72,39.34 9.04,40.02 4.89,40.02
  Bottom Layer w0.508: 9.22,26.88 9.22,26.81 v1(11.48,24.55)
  Bottom Layer w0.53: 4.99,40.02 4.28,39.31 4.28,31.81 9.21,26.88 ; 9.72,39.34 v1(9.75,39.34)
+5V: length 38.5
  Top Layer w0.203: RL1.2 23.5,9.62 22.76,10.36 17.32,10.36 ; 17.33,8.86 17.3,8.86
  Top Layer w0.508: 12.5,10.19 12.5,10.2 17.3,10.2 USB1.B4A9 ; 12.5,10.19 USB1.A4B9 ; 12.5,10.19 9.04,10.19 7.9,11.33 7.9,15.23 ; 6.86,21.64 8.27,21.64 8.78,21.13 8.78,16.18 7.9,15.3 7.9,15.23 ; 5,16.94 5.71,16.94 7,15.65 7.89,15.65 7.89,15.24 7.9,15.23
GND: length 27.8
  Top Layer w0.2: 16.03,9.03 16.03,8.82 16.34,8.51 16.34,8.48
  Top Layer w0.203: v1(26.72,38.17) 26.47,37.92 UART1.3 26.47,35.84 26.22,35.59
  Top Layer w0.254: 14.88,18.92 14.88,18.23 15.18,17.94 ; 19.59,19.7 19.81,19.48 20.51,19.48 ; 15.39,18.86 15.39,18.13 ; 4.12,42.32 1.07,42.32 ; 5.61,36.06 6.12,36.06
  Top Layer w0.5: 5.31,13.6 5.31,14.52 5.16,14.67 5.16,15.15
  Top Layer w0.508: 1.83,36.09 2.33,36.59 U1.2 ; 18.1,7.8 18.71,8.41
  Top Layer w0.53: 2.1,18.38 2.32,18.16 arc(2.63,17.95) 3,17.88 ; 2.29,17.67 2.34,17.72 arc(2.51,17.84) 2.71,17.88 ; 2.21,17.88 4.28,17.88 ; 3.75,17.88 4.02,18.15 arc(4.06,18.17) 4.1,18.18 ; 3.88,17.88 4.03,17.72 arc(4.21,17.61) 4.41,17.57
  Top Layer w0.6: 11.69,7.87 11.14,8.42
  Top Layer w0.75: 5.27,12.45 4.53,12.45 ; 5.41,11.05 5.41,10.19 5.42,10.18
  Top Layer w1: 10.63,7.28 11.31,7.28 ; 11.31,7.28 11.4,7.28 ; 11.31,7.28 11.48,7.44 ; 18.3,7.6 18.64,7.26 19.33,7.26
  Bottom Layer w0.508: 5.11,9.14 5.11,7.19
  Bottom Layer w1: 10.48,7.31 11.36,7.31 11.85,7.8 ; 19.26,7.38 18.55,7.38 18.12,7.81 ; 10.53,7.01 10.54,7
  vias: v1(0.78,35.91) v1(0.79,24.03) v1(0.81,21.11) v1(0.79,19.16) v1(0.8,17.85) v1(0.79,16.5) v1(0.79,14.73) v1(0.77,12.91) v1(0.78,11.04) v1(0.79,9.07) v1(0.86,30.12) v1(0.86,26.96) v1(1.52,35.91) v1(1.81,19.16) v1(1.83,17.88) v1(1.84,16.49) v1(2.24,35.91) v1(2.32,39.24) v1(2.32,38.5) v1(3.64,30.12) v1(3.66,24.05) v1(3.75,9.02) v1(3.74,5.34) v1(4.17,17.87) v1(4.4,16.11) v1(4.41,12.44) v1(4.61,19.75) v1(5.26,9.65) v1(5.95,36.94) v1(6.36,35.08) v1(6.45,24.06) v1(6.64,19.67) v1(6.82,14.58) v1(6.81,12.88) v1(6.82,11.02) v1(6.83,9.05) v1(6.98,35.69) v1(7.39,30.14) v1(9.24,24.04) v1(9.51,8.62) v1(9.9,41.81) v1(10.38,38.66) v1(10.36,35.73) v1(10.36,30.15) v1(10.36,26.95) v1(10.56,4.64) v1(10.56,0.71) v1(10.91,41.81) v1(11.04,18.77) v1(11.02,16.69) v1(11.01,14.58) v1(11.17,23.37) v1(11.3,21.18) v1(11.93,41.81) v1(12.95,41.81) v1(13.1,21.67) v1(13.19,8.49) v1(13.44,38.67) v1(13.44,32.89) v1(13.44,30.13) v1(13.43,16.69) v1(13.43,12.59) v1(13.44,3.82) v1(13.43,0.69) v1(13.45,35.75) v1(13.46,26.95) v1(13.46,24.05) v1(13.45,14.59) v1(13.96,41.81) v1(14.98,41.81) v1(15.99,41.81) v1(16.17,18.47) v1(16.34,38.66) v1(16.34,30.1) v1(16.34,26.94) v1(16.34,14.59) v1(16.34,12.55) v1(16.35,0.66) v1(16.36,35.76) v1(16.38,24.07) v1(16.38,16.71) v1(16.36,3.82) v1(16.61,8.49) v1(16.69,32.91) v1(17.01,41.81) v1(17.24,22.23) v1(18.03,41.81) v1(18.49,32.93) v1(18.83,22.23) v1(19.04,41.81) v1(19.14,36.21) v1(19.13,16.74) v1(19.2,38.67) v1(19.19,30.09) v1(19.16,26.94) v1(19.17,24.05) v1(19.19,14.64) v1(19.18,12.56) v1(19.21,0.67) v1(20.06,41.81) v1(20.1,21.12) v1(21.91,23.96) v1(21.9,18.82) v1(21.92,3.87) v1(21.96,21.13) v1(21.95,16.77) v1(22.03,0.62) v1(22.59,30.12) v1(23.28,7.76) v1(23.26,6.12) v1(24.6,41.5) v1(24.6,40.69) v1(24.65,27.07) v1(24.64,24.01) v1(24.63,21.12) v1(24.66,3.87) v1(24.66,0.61) v1(25.6,35.22) v1(25.94,18.83) v1(25.99,16.77) v1(25.98,14.64) v1(25.97,12.54) v1(26.09,38.56) v1(26.08,34.73) v1(26.3,32.81) v1(26.73,38.86) v1(27,29.24) v1(26.99,27.1) v1(27,24.01) v1(26.99,21.12) v1(26.97,5.18) v1(26.96,0.77) v1(28.07,36.53) v1(28.36,1.52) v1(29.04,30.35) v1(29.06,32.88) v1(29.08,27.07) v1(29.11,21.12) v1(29.11,18.82) v1(29.09,16.77) v1(29.09,14.64) v1(29.09,12.54) v1(29.09,10.33) v1(29.1,8.33) v1(29.08,6.07) v1(29.08,3.83) v1(29.17,24.02)
VIN: length 50.1
  Top Layer w0.254: RS1.1 4.42,33.39 1.55,33.39
  Top Layer w0.508: 1.55,33.39 1.53,33.41 ; 3.26,36.9 3.26,36.91 ; 3.26,36.9 3.26,37.18 U1.1 ; 3.26,36.9 3.26,35.92 1.94,34.59 U1.4 1.37,34.59 1.37,33.57 1.47,33.48
  Top Layer w0.53: 1.47,33.48 1.53,33.41 1.53,31.98 v1(2.21,31.3) ; 23.49,15.87 23.42,15.94 22.95,15.94 21.72,14.71 v1(21.72,14.69)
  Bottom Layer w0.53: v1(2.21,31.3) 2.24,31.34 3.49,31.34 10.12,24.7 10.12,13.62 13.17,10.57 19.45,10.57 21.72,12.84 v1(21.72,14.69)
ADC: length 10
  Top Layer w0.254: 7.42,38.92 7.42,38.92 v1(8.97,38.92) ; VD2.2 5.49,32.32 VD1.1 5.92,33.34 6.5,33.92 6.5,33.93 v1(8,35.44)
  Bottom Layer w0.254: v1(8,35.44) 8.03,35.44 8.97,36.38 v1(8.97,38.92)
BAT+: length 22.1
  Top Layer w0.508: Q1.3 10.19,21.33 9.47,22.05 v1(9.36,22.05)
  Top Layer w0.53: 3.35,14.27 2.88,14.74 v1(2.88,15.32) ; 3.41,16.84 3.62,16.63 3.62,15.6 ; v1(3.4,10.15) 3.4,10.15 3.4,11.8 ; 3.73,15.17 3.73,14.66 3.35,14.28
  Bottom Layer w0.5: 2.65,7.14 2.65,9.4 3.39,10.15 v1(3.4,10.15)
  Bottom Layer w0.508: v1(2.88,15.32) 3.41,15.85 3.41,20.1 5.36,22.05 v1(9.36,22.05)
BATO: length 23.3
  Top Layer w0.508: 7.9,18.11 7.89,18.12 v1(7.89,18.99) Q1.2 ; 23.5,13.09 23.21,13.09 21.84,11.72 11.01,11.72 9.43,13.3 9.43,14.97 v1(9.43,14.98)
  Bottom Layer w0.508: v1(9.43,14.98) 9.43,17.46 v1(7.89,18.99)
BTS: length 1
  Top Layer w0.254: RS1.2 VD1.2
CC1: length 14.1
  Top Layer w0.254: USB1.A5 13.65,5.74 14.83,4.56 20.59,4.56 21.49,5.46 21.49,8.94 RD1.2
CC2: length 10.2
  Top Layer w0.254: USB1.B5 16.65,5.66 17.19,5.12 20.39,5.12 21,5.73 21,8.67 20.58,9.1
CTS: length 3.8
  Top Layer w0.254: R8.2 28.63,35.84 28.38,35.59 27.74,35.59 27.47,35.86 UART1.5
DN: length 45.8
  Top Layer w0.254: 14.6,8.52 14.6,8.51 v1(14.62,8.49) 14.62,8.54 ; 14.6,8.52 14.15,8.07 USB1.B7 ; 14.6,8.52 14.55,8.52 14.55,9.4 14.52,9.43 ; 14.6,8.52 14.62,8.54 ; 24.75,38.51 25.1,38.51 25.97,37.65 25.97,36.77 ; 14.62,8.54 14.65,8.57 14.65,8.57 15.15,8.07 15.15,7.49 USB1.A7
  Bottom Layer w0.254: v1(14.62,8.49) 15.93,9.79 19.72,9.79 22.52,12.59 22.52,27.55 19.18,30.89 19.18,33.73 23.95,38.5 24.77,38.5
  vias: v1(24.76,38.5)
DP: length 44.1
  Top Layer w0.254: 15.37,9.43 15.39,9.41 15.39,8.83 15.64,8.58 15.64,8.47 v1(15.62,8.45) 15.62,6.86 15.39,6.63 14.88,6.63 14.66,6.85 14.66,7.1 14.65,7.12 ; UART1.1 25.47,37.45 25.17,37.75 v1(25.04,37.75)
  Bottom Layer w0.254: v1(25.04,37.75) 23.8,37.75 19.56,33.51 19.56,31.05 22.98,27.63 22.98,12.39 19.95,9.37 16.51,9.37 15.62,8.47 v1(15.62,8.45)
EN: length 34.8
  Top Layer w0.254: 2.39,41.3 2.39,41.21 2.86,40.74 5.22,40.74 5.89,40.08 5.89,38.52 7.5,36.91 ; 7.59,36.88 10.36,36.88 16.46,30.79 25.36,30.79 26.97,32.39 UART1.4
FB: length 2.5
  Top Layer w0.254: 5.52,35.28 4.5,35.28
  Top Layer w0.508: 4.5,35.28 3.97,35.28 U1.5
G: length 27.2
  Top Layer w0.254: P1.5 5.98,17.88 6,17.86 v1(6.76,17.86) ; v1(8.64,11.72) 8.64,11.69 9.62,10.71 25.59,10.71 26.3,10 LED1.4
  Bottom Layer w0.254: v1(6.76,17.86) 8.06,16.56 8.06,12.27 8.61,11.72 v1(8.64,11.72)
GPIO0: length 19.9
  Top Layer w0.254: v1(20.5,32.92) 23.85,32.92 R3.2 ; UART1.6 v1(27.47,39.34) R8.1
  Bottom Layer w0.254: v1(27.47,39.34) 27.47,34.94 25.46,32.92 v1(20.5,32.92)
GPIO15: length 4.8
  Top Layer w0.254: 22.3,28.9 24.35,28.9 25.81,30.37 26.44,30.37 26.48,30.4
INT: length 19.7
  Top Layer w0.254: U5.4 13.62,19.18 13.62,18.58 ; ESP1.5 7.55,32.93 10.41,32.93 v1(10.44,32.9)
  Bottom Layer w0.254: v1(10.44,32.9) 12.13,31.2 12.13,19.16 12.72,18.57 13.62,18.57 v1(13.62,18.58)
LED+: length 2.8
  Top Layer w0.203: RL1.1 24.36,8.53 25.2,7.69 26.3,7.69 LED1.3
PROG: length 2.5
  Top Layer w0.254: 5.58,18.85 5.69,18.96 5.69,20.17 5.18,20.68 4.82,20.68 RA1.1
R: length 30.7
  Top Layer w0.254: v1(4.51,18.83) 3.24,18.83 P1.1 ; LED1.1 27.4,9.75 25.99,11.16 10.24,11.16 8.63,12.77 v1(8.63,13.13)
  Bottom Layer w0.254: v1(4.51,18.83) 6.63,18.83 8.63,16.83 8.63,13.13 v1(8.63,13.13)
RST: length 2.8
  Top Layer w0.254: 7.42,40.92 7.04,41.3 R2.2
RX: length 5.6
  Top Layer w0.254: 22.52,38.92 22.87,39.27 26.09,39.27 26.47,39.65 UART1.8
SCL: length 23.1
  Top Layer w0.254: 24.57,36.28 23.98,36.86 20.86,36.86 19.5,35.51 18.39,35.51 v1(18.38,35.52) ; v1(14.85,22.13) 14.89,22.09 U5.13
  Bottom Layer w0.254: v1(14.85,22.13) 14.89,22.17 14.89,32.03 18.38,35.52 v1(18.38,35.52)
SCX: length 8
  Top Layer w0.254: U5.3 13.1,19.68 12.93,19.5 v1(12.71,19.5) ; 18.44,18.72 18.44,19.4 18.51,19.47 18.96,19.47 19.19,19.71
  Bottom Layer w0.254: 13.02,19.48 18.44,19.48
  vias: v1(18.44,19.47)
SDA: length 23.5
  Top Layer w0.254: v1(14.11,22.07) 14.11,22.07 14.39,21.8 U5.14 ; R4.2 24.45,33.38 22.9,34.92 17.04,34.92 v1(17.02,34.95)
  Bottom Layer w0.254: v1(17.02,34.95) 14.11,32.05 v1(14.11,22.07)
SDX: length 8.2
  Top Layer w0.254: 18.53,20.3 19.02,20.3 19.2,20.12 19.2,20.1 ; v1(12.72,20.35) 12.9,20.35 13.08,20.17 13.64,20.17 ; 18.43,20.35 18.43,21.06
  Bottom Layer w0.254: v1(12.72,20.35) 12.75,20.32 18.45,20.32 18.45,20.32
  vias: v1(18.45,20.31)
SW: length 1.9
  Top Layer w0.508: L1.1 1.38,38.92 U1.3
TX: length 5
  Top Layer w0.254: UART1.9 25.97,40.03 25.72,39.78 24.19,39.78 23.04,40.92 22.52,40.92

## Copper pours and planes (outline as drawn; the poured copper is in the pictures)
GND on Top Layer: -7.47,50.41 31.27,50.41 31.27,-1.15 -7.47,-1.15
GND on Bottom Layer: -1.07,57.36 37.41,57.36 37.41,-0.8 -1.07,-0.8

## Text on the board
Bottom Solder Mask Layer: rev paw-4
Bottom Silkscreen Layer: ブルーベリー | 」 | 「 | (BB-LSM6DSV) | v2.2.1 | + | - | blueberry | DIY SlimeVR | CheeseCake
Document Layer: Y | TP4057:2K | Some pins on ESP-12F was removed due to easy wiring | AD0=L / IIC ADDR=0X68 | OPENPAWLABS.COM | PawTracker
Top Solder Mask Layer: - | 5V | 400mA
Top Silkscreen Layer: + | - | 「 | CheeseCake | SlimeVR | 」 | UART | Z | Y | X | Bakery | blueberry | LSM6DSV | USB | DCDC | SK's
